# EAGLE design satshakit_fc (EAGLE 7.5.0)
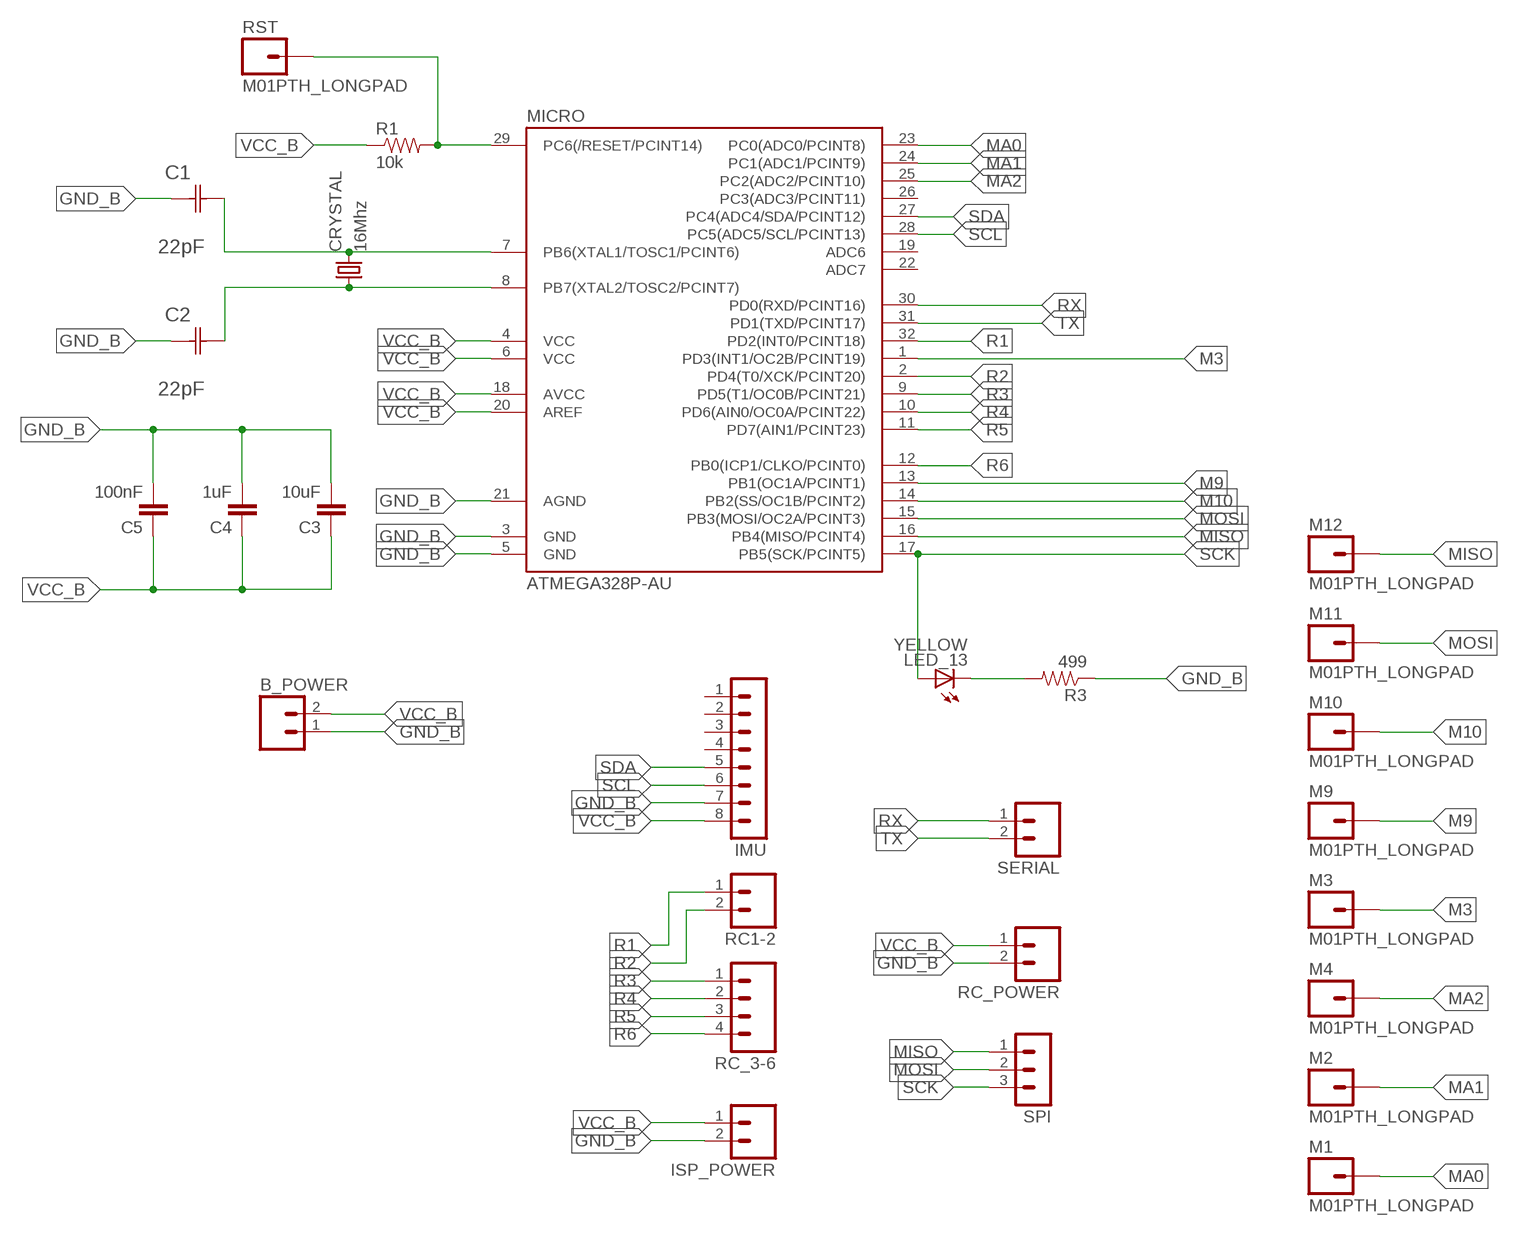
[diagram p0: schematic, sheet 1]

## Parts
B_POWER  M02LOCK_LONGPADS  [1X02_LOCK_LONGPADS]
C1  22pF  0612ZC225MAT2A  [CAPC3216X178N]
C2  22pF  0612ZC225MAT2A  [CAPC3216X178N]
C3  10uF  CAP1206  [1206]
C4  1uF  CAP1206  [1206]
C5  100nF  CAP1206  [1206]
CRYSTAL  16Mhz  CSM-7X-DU  [CSM-7X-DU]
IMU  MA08-1  [MA08-1]
ISP_POWER  M02LOCK_LONGPADS  [1X02_LOCK_LONGPADS]
LED_13  YELLOW  LED1206  [1206]
M1  M01PTH_LONGPAD  [1X01_LONGPAD]
M2  M01PTH_LONGPAD  [1X01_LONGPAD]
M3  M01PTH_LONGPAD  [1X01_LONGPAD]
M4  M01PTH_LONGPAD  [1X01_LONGPAD]
M9  M01PTH_LONGPAD  [1X01_LONGPAD]
M10  M01PTH_LONGPAD  [1X01_LONGPAD]
M11  M01PTH_LONGPAD  [1X01_LONGPAD]
M12  M01PTH_LONGPAD  [1X01_LONGPAD]
MICRO  ATMEGA328P-AU  ATMEGA48/88/168-AU  [TQFP32-08]
R1  10k  RESISTOR1206  [1206]
R3  499  RESISTOR1206  [1206]
RC1-2  M02  [02P]
RC_3-6  M04LONGPADS  [1X04_LONGPADS]
RC_POWER  M02LOCK_LONGPADS  [1X02_LOCK_LONGPADS]
RST  M01PTH_LONGPAD  [1X01_LONGPAD]
SERIAL  M02LOCK_LONGPADS  [1X02_LOCK_LONGPADS]
SPI  MA03-1  [MA03-1]

## Nets
GND_B: B_POWER.1 C1.1(C1) C2.1(C1) C3.2 C4.2 C5.2 IMU.7 ISP_POWER.2 MICRO.3(GND) MICRO.5(GND) MICRO.21(AGND) R3.1 RC_POWER.2
M3: M3.1 MICRO.1(PD3(INT1/OC2B/PCINT19))
M9: M9.1 MICRO.13(PB1(OC1A/PCINT1))
M10: M10.1 MICRO.14(PB2(SS/OC1B/PCINT2))
MA0: M1.1 MICRO.23(PC0(ADC0/PCINT8))
MA1: M2.1 MICRO.24(PC1(ADC1/PCINT9))
MA2: M4.1 MICRO.25(PC2(ADC2/PCINT10))
MISO: M12.1 MICRO.16(PB4(MISO/PCINT4)) SPI.1
MOSI: M11.1 MICRO.15(PB3(MOSI/OC2A/PCINT3)) SPI.2
N$2: C1.2(C2) CRYSTAL.2 MICRO.7(PB6(XTAL1/TOSC1/PCINT6))
N$3: MICRO.29(PC6(/RESET/PCINT14)) R1.2 RST.1
N$9: C2.2(C2) CRYSTAL.1 MICRO.8(PB7(XTAL2/TOSC2/PCINT7))
N$27: LED_13.2(C) R3.2
R1: MICRO.32(PD2(INT0/PCINT18)) RC1-2.1
R2: MICRO.2(PD4(T0/XCK/PCINT20)) RC1-2.2
R3: MICRO.9(PD5(T1/OC0B/PCINT21)) RC_3-6.1
R4: MICRO.10(PD6(AIN0/OC0A/PCINT22)) RC_3-6.2
R5: MICRO.11(PD7(AIN1/PCINT23)) RC_3-6.3
R6: MICRO.12(PB0(ICP1/CLKO/PCINT0)) RC_3-6.4
RX: MICRO.30(PD0(RXD/PCINT16)) SERIAL.1
SCK: LED_13.1(A) MICRO.17(PB5(SCK/PCINT5)) SPI.3
SCL: IMU.6 MICRO.28(PC5(ADC5/SCL/PCINT13))
SDA: IMU.5 MICRO.27(PC4(ADC4/SDA/PCINT12))
TX: MICRO.31(PD1(TXD/PCINT17)) SERIAL.2
VCC_B: B_POWER.2 C3.1 C4.1 C5.1 IMU.8 ISP_POWER.1 MICRO.4(VCC) MICRO.6(VCC) MICRO.18(AVCC) MICRO.20(AREF) R1.1 RC_POWER.1
Unconnected: IMU.1 IMU.2 IMU.3 IMU.4 MICRO.19(ADC6) MICRO.22(ADC7) MICRO.26(PC3(ADC3/PCINT11))

## Library data of the parts
B_POWER ISP_POWER RC_POWER SERIAL = 01_SparkFun:M02: Header 2 Standard 2-pin 0.1" header. Use with straight break away headers (SKU : PRT-00116), right angle break away headers (PRT-00553), swiss pins (PRT-00743), machine pins (PRT-00117), and female headers (PRT-00115). Molex polarized connector foot print use with SKU : PRT-08233 with associated crimp pins and housings.
C1 C2 = AVX_By_element14_Batch_1:0612ZC225MAT2A: Capacitor 1206; MPN: 0612ZC225MAT2A; OC_FARNELL: -; OC_NEWARK: 12N3209; SUPPLIER: AVX; TOLERANCE: ±20%; VALUE: 2.2µF; VOLTAGERATING: 10V
C3-C5 = 01_SparkFun:CAP: Capacitor Standard 0603 ceramic capacitor, and 0.1" leaded capacitor.
CRYSTAL = 01_FAB_Hello:CSM-7X-DU: SMD CRYSTAL Source: www.ecsxtal.com .. Crystal 3.6864MHz CSM_7X_DU.PDF; OC_FARNELL: unknown; OC_NEWARK: unknown
IMU = con-lstb:MA08-1: PIN HEADER; OC_FARNELL: unknown; OC_NEWARK: unknown
LED_13 = 01_FAB_Hello:LED
M1-M4 M9-M12 RST = 01_SparkFun:M01: Header 1 Standard 1-pin 0.1" header. Use with straight break away headers (SKU : PRT-00116), right angle break away headers (PRT-00553), swiss pins (PRT-00743), machine pins (PRT-00117), and female headers (PRT-00115).
MICRO = atmega8:ATMEGA48/88/168
R1 R3 = 01_SparkFun:RESISTOR: Resistor Basic schematic elements and footprints for 0603, 1206, and PTH 1/10th watt (small) resistors.
RC1-2 = con-amp-quick:M02: AMP QUICK CONNECTOR; OC_FARNELL: unknown; OC_NEWARK: unknown
RC_3-6 = 01_SparkFun:M04: Header 4 Standard 4-pin 0.1" header. Use with straight break away headers (SKU : PRT-00116), right angle break away headers (PRT-00553), swiss pins (PRT-00743), machine pins (PRT-00117), and female headers (PRT-00115). Molex polarized connector foot print use with SKU : PRT-08231 with associated crimp pins and housings.
SPI = con-lstb:MA03-1: PIN HEADER; OC_FARNELL: unknown; OC_NEWARK: unknown

## Board
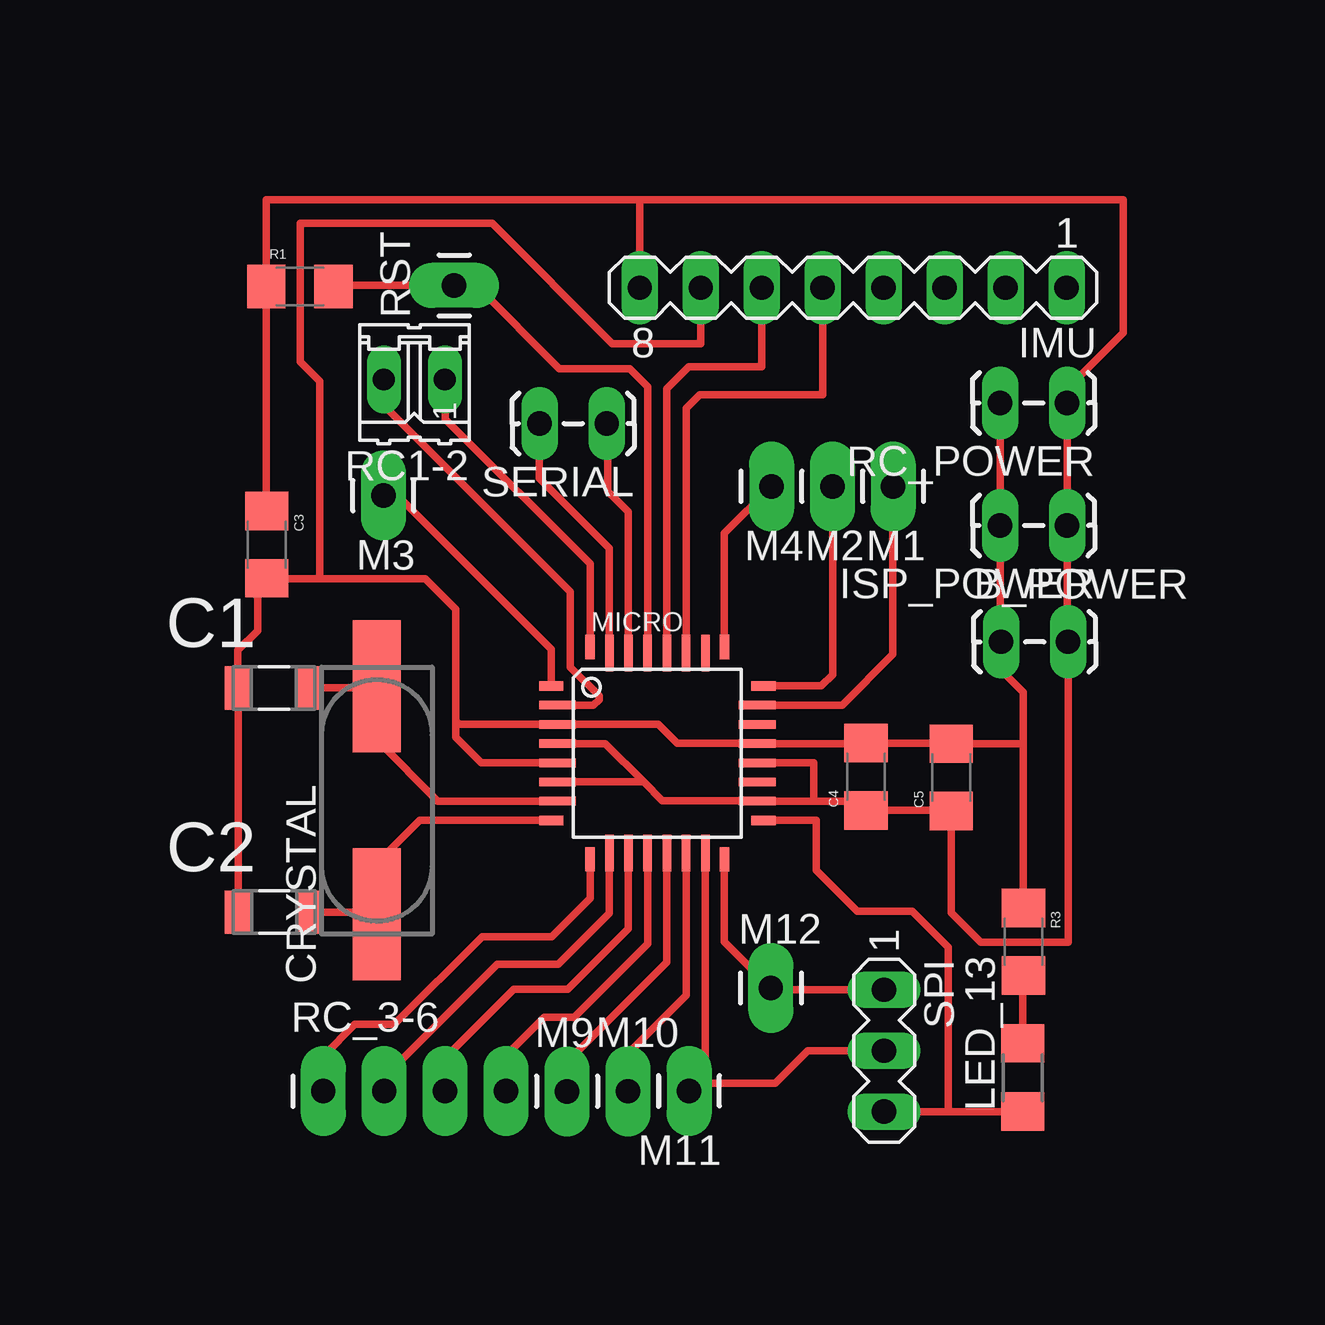
[diagram p1: board, top side]
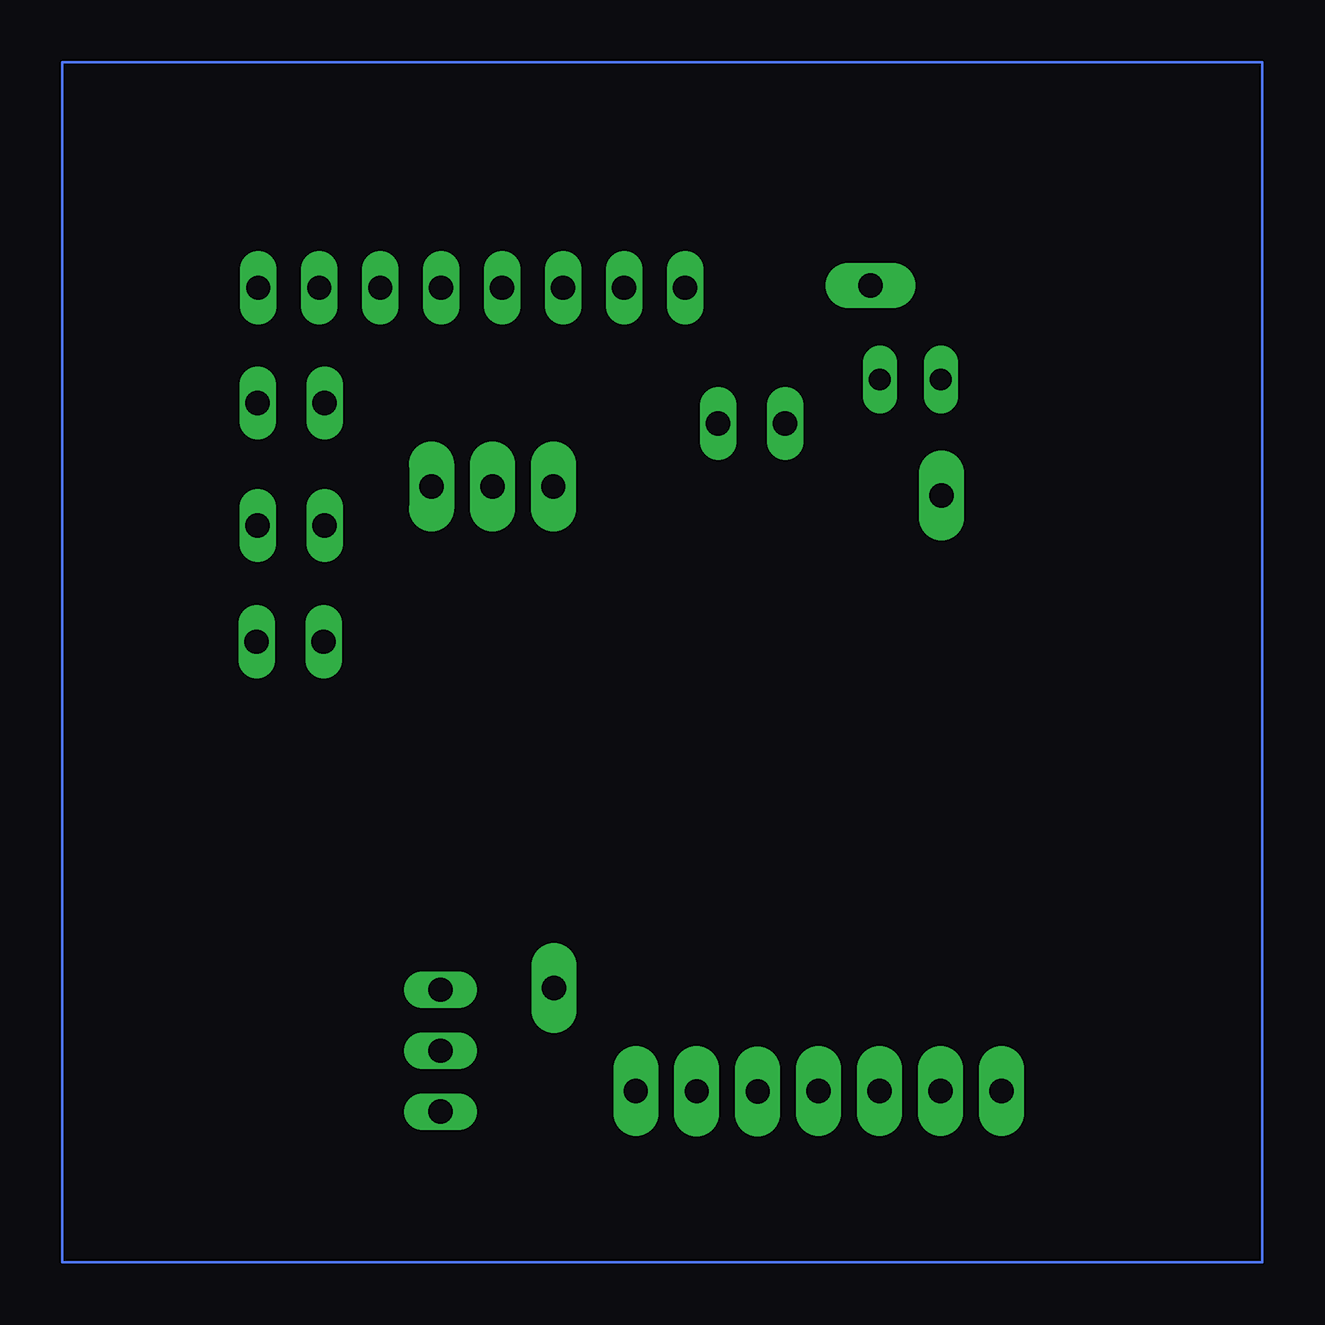
[diagram p2: board, bottom side, seen from below]

No outline drawn. Coordinates in mm, seen from the top.
Copper layers (1*16): Top 0.035mm / dielectric 1.5mm / Bottom 0.035mm
Design rules "default": minimum track width 10mil, minimum drill 24mil, track to track 8mil, track to pad 8mil, pad to pad 8mil, via to via 8mil, smd to smd 8mil, copper to edge 40mil, drill to drill 8mil, minimum pad ring 10mil, minimum via ring 8mil, stop-mask expansion 4mil, vias tented up to drill 0mil, thermal gap 10mil

### Footprints (pad centres in the part's own frame; a part is rotated, then mirrored left to right if it is on the bottom)
1X02_LOCK_LONGPADS = drill 1.016 long: 1 -0.127,0; 2 2.667,0
CAPC3216X178N = smd 1.118 x 1.803: 1 -1.499,0; 2 1.499,0
1206 = smd 1.6 x 1.8: 1 -1.4,0; 2 1.4,0
CSM-7X-DU = smd 5.5 x 2: 1 -4.75,0; 2 4.75,0
MA08-1 = drill 1.016 long: 1 -8.89,0; 2 -6.35,0; 3 -3.81,0; 4 -1.27,0; 5 1.27,0; 6 3.81,0; 7 6.35,0; 8 8.89,0
1206' = smd 1.6 x 1.803: 1 -1.422,0; 2 1.422,0
1X01_LONGPAD = drill 1.016 pad 1.88 long: 1 0,0
TQFP32-08 = smd 1.016 x 0.406: 1 -4.42,2.8; 8 -4.42,-2.8; 17 4.42,-2.8; 24 4.42,2.8 | smd 1.524 x 0.356: 2 -4.166,2; 3 -4.166,1.2; 4 -4.166,0.4; 5 -4.166,-0.4; 6 -4.166,-1.2; 7 -4.166,-2; 18 4.166,-2; 19 4.166,-1.2; 20 4.166,-0.4; 21 4.166,0.4; 22 4.166,1.2; 23 4.166,2 | smd 0.406 x 1.016: 9 -2.8,-4.42; 16 2.8,-4.42; 25 2.8,4.42; 32 -2.8,4.42 | smd 0.356 x 1.524: 10 -2,-4.166; 11 -1.2,-4.166; 12 -0.4,-4.166; 13 0.4,-4.166; 14 1.2,-4.166; 15 2,-4.166; 26 2,4.166; 27 1.2,4.166; 28 0.4,4.166; 29 -0.4,4.166; 30 -1.2,4.166; 31 -2,4.166
02P = drill 0.914 long: 1 -1.27,0; 2 1.27,0
1X04_LONGPADS = drill 1.016 pad 1.88 long: 1 0,0; 2 2.54,0; 3 5.08,0; 4 7.62,0
MA03-1 = drill 1.016 long: 1 -2.54,0; 2 0,0; 3 2.54,0

### Placement (x,y rotation side)
B_POWER  65.24,43.86 0 top
C1  34.81,41.94 0 top
C2  34.83,32.59 0 top
C3  34.51,47.91 270 top
C4  59.48,38.24 90 top
C5  63.03,38.21 90 top
CRYSTAL  39.1,37.25 90 top
IMU  58.95,58.61 180 top
ISP_POWER  67.74,48.7 180 top
LED_13  YELLOW  [1206']  66.01,25.71 90 top
M1  60.62,50.33 180 top
M2  58.08,50.33 180 top
M3  39.38,49.95 180 top
M4  55.55,50.33 180 top
M9  47.03,25.13 0 top
M10  49.57,25.13 0 top
M11  52.11,25.14 180 top
M12  55.52,29.43 0 top
MICRO  50.79,39.22 0 top
R1  35.9,58.66 0 top
R3  66.04,31.36 270 top
RC1-2  40.67,54.79 180 top
RC_3-6  36.87,25.13 0 top
RC_POWER  67.74,53.81 180 top
RST  42.32,58.7 90 top
SERIAL  48.55,52.95 180 top
SPI  60.24,26.82 270 top

### Tracks (layer width: path | path; a pad name or v marks a point on that pad's centre or on a via)
GND_B
  Top 0.305: 66.04,39.61 C5.2 63.03,39.64 C4.2 59.48,39.62 MICRO.21 51.61,39.62 50.82,40.42 MICRO.3 | 66.04,39.61 R3.1 | MICRO.3 44.45,40.42 | MICRO.5 43.46,38.81 42.39,39.88 42.39,40.56 | 66.04,39.61 66.04,41.76 65.13,42.67 65.13,43.85 B_POWER.1 65.07,43.9 ISP_POWER.2 RC_POWER.2 | 36.73,46.48 34.54,46.48 | 34.54,46.48 C3.2 | 36.73,46.48 36.73,54.71 35.92,55.52 35.92,61.29 43.92,61.29 48.92,56.29 52.6,56.29 IMU.7 | 42.39,40.56 42.39,45.21 41.12,46.48 36.73,46.48 | MICRO.3 42.54,40.42 42.39,40.56 | C2.1 33.33,41.94 C1.1 33.31,43.5 34.14,44.32 34.14,45.73 33.96,45.91 34.54,46.48
M3
  Top 0.305: MICRO.1 46.37,43.55 40.08,49.84 39.49,49.84 M3.1
M9
  Top 0.305: MICRO.13 51.19,30.51 47.17,26.49 47.17,25.27 M9.1
M10
  Top 0.305: MICRO.14 51.99,29.13 49.53,26.67 49.53,26.36 49.57,26.33 M10.1
MA0
  Top 0.305: MICRO.23 58.49,41.22 60.6,43.33 60.6,50.32 M1.1
MA1
  Top 0.305: MICRO.24 57.61,42.02 58.09,42.49 M2.1
MA2
  Top 0.305: MICRO.25 53.59,48.38 M4.1
MISO
  Top 0.305: MICRO.16 53.59,31.36 M12.1 55.59,29.36 SPI.1
MOSI
  Top 0.305: SPI.2 57.05,26.82 55.7,25.47 52.44,25.47 M11.1 52.79,25.14 MICRO.15
N$2
  Top 0.305: MICRO.7 41.65,37.22 39.14,39.73 39.14,41.96 CRYSTAL.2 39.1,41.94 C1.2
N$3
  Top 0.305: R1.2 37.3,58.7 RST.1 43.26,58.7 46.71,55.24 49.63,55.24 50.39,54.49 MICRO.29
N$9
  Top 0.305: C2.2 39.1,32.59 CRYSTAL.1 39.14,32.54 39.14,34.67 40.89,36.42 MICRO.8
N$25
  Bottom 0.1: 26,68 76,68 76,18 26,18 26,68
N$27
  Top 0.305: R3.2 66.01,29.96 LED_13.2
R1
  Top 0.305: MICRO.32 47.99,47.11 41.96,53.14 41.96,54.79 RC1-2.1
R2
  Top 0.305: MICRO.2 48.13,41.22 48.36,41.45 48.36,41.6 47.17,42.8 47.17,45.95 39.42,53.7 39.42,54.79 RC1-2.2
R3
  Top 0.305: MICRO.9 47.99,33.18 46.38,31.57 43.48,31.57 39.83,27.91 38.18,27.91 36.88,26.62 36.88,25.15 RC_3-6.1
R4
  Top 0.305: MICRO.10 48.79,32.56 46.66,30.43 44.12,30.43 39.7,26.01 39.7,25.43 RC_3-6.2
R5
  Top 0.305: MICRO.11 49.59,31.91 47.07,29.39 44.81,29.39 42.11,26.7 42.11,25.3 RC_3-6.3
R6
  Top 0.305: MICRO.12 50.39,31.29 47.32,28.22 46.08,28.22 44.53,26.67 44.53,25.17 RC_3-6.4
RX
  Top 0.305: MICRO.30 49.59,49.27 48.72,50.14 48.72,52.91 SERIAL.1
SCK
  Top 0.305: LED_13.1 62.92,24.29 | 62.92,24.29 SPI.3 | MICRO.17 57.42,36.42 57.42,34.33 59.12,32.63 61.42,32.63 62.92,31.13 62.92,24.29
SCL
  Top 0.305: MICRO.28 51.19,54.4 52.11,55.32 55.14,55.32 IMU.6
SDA
  Top 0.305: MICRO.27 51.99,53.59 52.55,54.15 57.68,54.15 IMU.5 57.71,58.61
TX
  Top 0.305: MICRO.31 48.79,47.76 45.87,50.67 45.87,52.93 SERIAL.2
VCC_B
  Top 0.305: 57.3,37.22 MICRO.18 54.93,37.24 51,37.24 50.22,38.02 | 57.3,37.22 59.48,37.22 C4.1 63.01,36.84 C5.1 63.03,32.57 64.26,31.34 67.91,31.34 B_POWER.2 67.87,43.9 ISP_POWER.1 RC_POWER.1 67.87,54.4 70.21,56.74 70.21,62.28 50.06,62.28 | MICRO.20 57.3,38.82 57.3,37.22 | MICRO.6 50.22,38.02 | MICRO.4 48.62,39.62 50.22,38.02 | C3.1 34.49,49.3 R1.1 34.49,62.28 50.06,62.28 | IMU.8 50.06,62.28